# EAGLE schematic SMD_optek_driver_led-mosfet002 (EAGLE 6.2)
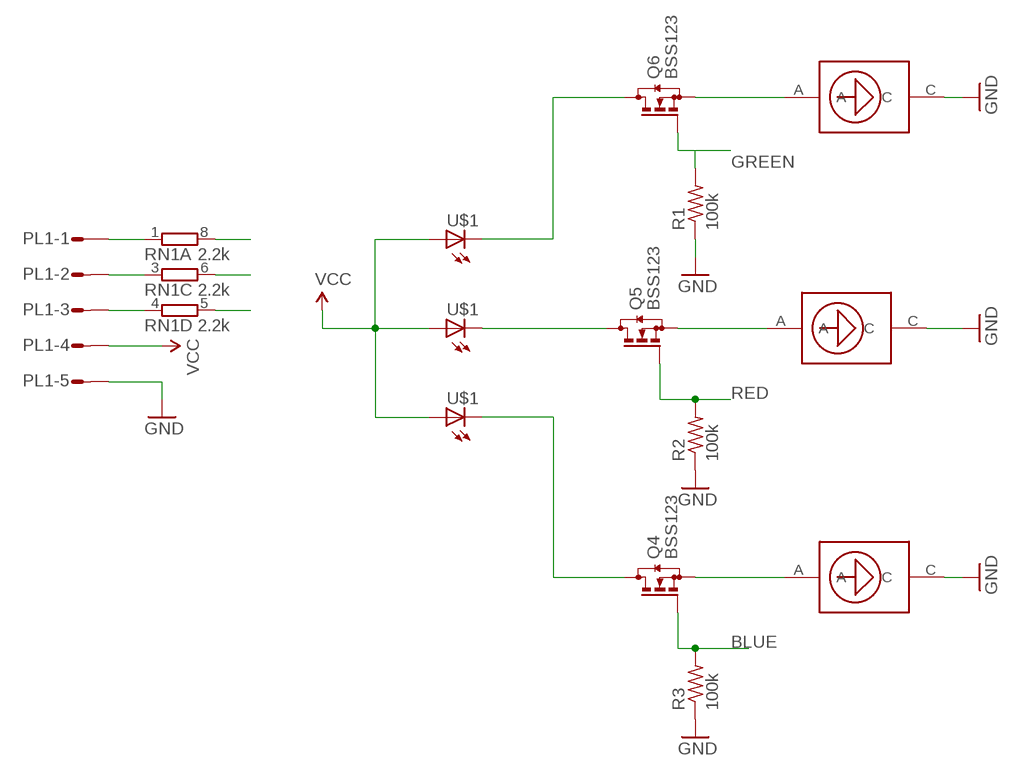
[diagram p0: schematic, sheet 1]

## Parts
PL1  DF3-05R  [DF3R-05]
Q4  BSS123  [SOT23]
Q5  BSS123  [SOT23]
Q6  BSS123  [SOT23]
R1  100k  R-US_R0402  [R0402]
R2  100k  R-US_R0402  [R0402]
R3  100k  R-US_R0402  [R0402]
RN1  2.2k  4R-N0603-ARC  [0603-ARC]
U$1  OVSPRGBCR4  [OVSPRGBCR4]
U$2  NSI50350AST3G  [SMC-2]
U$3  NSI50350AST3G  [SMC-2]
U$4  NSI50350AST3G  [SMC-2]

## Nets
BLUE [sig]: Q4.1(G) R3.2 RN1.5
BLUE_OUT [sig]: PL1.3 RN1.4
GND: PL1.5 R1.1 R2.1 R3.1 U$2.C U$3.C U$4.C
GREEN [sig]: Q6.1(G) R1.2 RN1.8
GREEN_OUT [sig]: PL1.1 RN1.1
N$1: Q6.3(D) U$1.6(GREEN_C)
N$2: Q5.3(D) U$1.5(RED_C)
N$3: Q4.3(D) U$1.4(BLUE_C)
N$4: Q6.2(S) U$2.A
N$6: Q4.2(S) U$4.A
N$7: Q5.2(S) U$3.A
RED [sig]: Q5.1(G) R2.2 RN1.6
RED_OUT [sig]: PL1.2 RN1.3
VCC: PL1.4 U$1.1(GREEN_A) U$1.2(RED_A) U$1.3(BLUE_A)
Unconnected: RN1.2 RN1.7

## Library data of the parts
PL1 = con-hirose-df3:DF3-05: Single row connector 2mm 5 way
Q4-Q6 = transistor-small-signal:BSS123: N-CHANNEL MOS FET
R1-R3 = resistor:R-US_: RESISTOR, American symbol
RN1 = resistor-dil:4R-N: Array Chip Resistor Source: RS Component / Phycomp; OC_FARNELL: unknown; OC_NEWARK: unknown
U$1 = led:OVSPRGBCR4
U$2-U$4 = on-semiconductor:NSI50350AST3G

## Net classes
0 default: width 0.813 mm
1 sig: width 0.305 mm